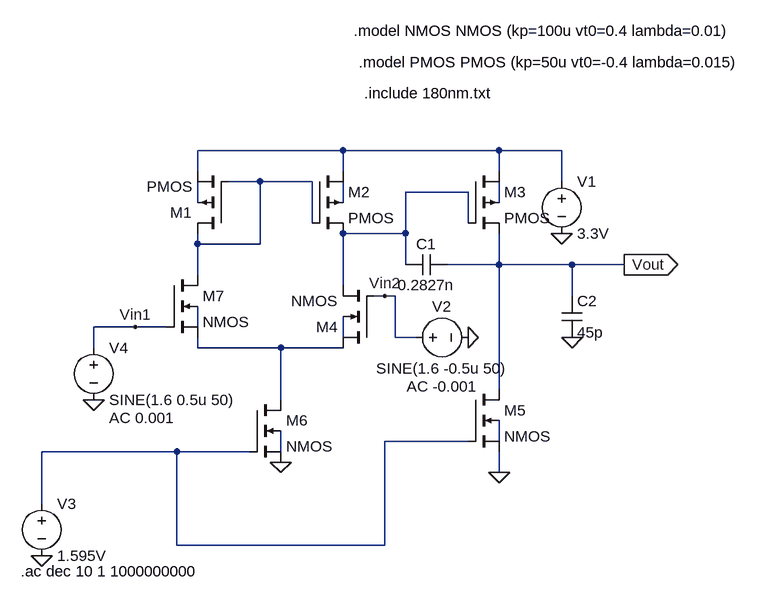
[diagram p0: schematic CourseProjectSchematic.asc]
CourseProjectSchematic.asc, the LTspice schematic file:
Version 4
SHEET 1 976 680
WIRE 272 16 48 16
WIRE 512 16 272 16
WIRE 608 16 512 16
WIRE 48 48 48 16
WIRE 272 48 272 16
WIRE 512 48 512 16
WIRE 144 64 96 64
WIRE 224 64 144 64
WIRE 608 64 608 16
WIRE 464 80 368 80
WIRE 48 96 48 64
WIRE 272 96 272 64
WIRE 512 96 512 64
WIRE 224 128 224 64
WIRE 464 128 464 80
WIRE 368 144 368 80
WIRE 368 144 272 144
WIRE 48 160 48 144
WIRE 144 160 144 64
WIRE 144 160 48 160
WIRE 368 192 368 144
WIRE 512 192 512 144
WIRE 512 192 432 192
WIRE 624 192 512 192
WIRE 704 192 624 192
WIRE 48 208 48 160
WIRE 272 224 272 144
WIRE 336 240 320 240
WIRE 352 240 336 240
WIRE 624 240 624 192
WIRE -48 288 -112 288
WIRE 0 288 -48 288
WIRE 48 288 48 256
WIRE 272 304 272 272
WIRE 352 304 352 240
WIRE 384 304 352 304
WIRE -112 320 -112 288
WIRE 48 320 48 304
WIRE 176 320 48 320
WIRE 272 320 176 320
WIRE 512 384 512 192
WIRE 176 400 176 320
WIRE 464 464 336 464
WIRE 512 464 512 432
WIRE 16 480 -192 480
WIRE 128 480 16 480
WIRE 176 480 176 448
WIRE 512 512 512 480
WIRE -192 560 -192 480
WIRE 16 624 16 480
WIRE 336 624 336 464
WIRE 336 624 16 624
FLAG 608 144 0
FLAG 464 304 0
FLAG 512 512 0
FLAG -192 640 0
FLAG 176 496 0
FLAG -112 400 0
FLAG 704 192 Vout
IOPIN 704 192 Out
FLAG 624 304 0
FLAG -48 288 Vin1
FLAG 336 240 Vin2
SYMBOL pmos4 96 144 R180
SYMATTR InstName M1
SYMATTR Value2 l=0.18u w=0.93u
SYMBOL pmos4 224 48 R0
SYMATTR InstName M2
SYMATTR Value2 l=0.18u w=0.93u
SYMBOL pmos4 464 48 R0
SYMATTR InstName M3
SYMATTR Value2 l=0.18u w=8.784u
SYMBOL voltage 608 48 R0
WINDOW 123 0 0 Left 2
WINDOW 39 0 0 Left 2
SYMATTR InstName V1
SYMATTR Value 3.3V
SYMBOL cap 368 208 R270
WINDOW 0 32 32 VTop 2
WINDOW 3 0 32 VBottom 2
SYMATTR InstName C1
SYMATTR Value 0.2827n
SYMBOL nmos4 320 320 R180
SYMATTR InstName M4
SYMATTR Value2 l=0.18u w=30520u
SYMBOL voltage 368 304 R270
WINDOW 0 32 56 VTop 2
WINDOW 3 -32 56 VBottom 2
WINDOW 123 -60 56 VBottom 2
WINDOW 39 0 0 Left 2
SYMATTR InstName V2
SYMATTR Value SINE(1.6 -0.5u 50)
SYMATTR Value2 AC -0.001
SYMBOL nmos4 464 384 R0
SYMATTR InstName M5
SYMATTR Value2 l=0.18u w=5.04198u
SYMBOL voltage -192 544 R0
WINDOW 123 0 0 Left 2
WINDOW 39 0 0 Left 2
SYMATTR InstName V3
SYMATTR Value 1.595V
SYMBOL nmos4 128 400 R0
SYMATTR InstName M6
SYMATTR Value2 l=0.18u w=1.069u
SYMBOL nmos4 0 208 R0
SYMATTR InstName M7
SYMATTR Value2 l=0.18u w=30520u
SYMBOL voltage -112 304 R0
WINDOW 123 24 124 Left 2
WINDOW 39 0 0 Left 2
SYMATTR Value2 AC 0.001
SYMATTR InstName V4
SYMATTR Value SINE(1.6 0.5u 50)
SYMBOL cap 608 240 R0
SYMATTR InstName C2
SYMATTR Value 45p
TEXT 288 -168 Left 2 !.model NMOS NMOS (kp=100u vt0=0.4 lambda=0.01)
TEXT 296 -120 Left 2 !.model PMOS PMOS (kp=50u vt0=-0.4 lambda=0.015)
TEXT -224 664 Left 2 !.ac dec 10 1 1000000000
TEXT 304 -72 Left 2 !.include 180nm.txt

The netlist it stands for:
* CourseProjectSchematic.asc
M1 N002 N002 N001 N004 PMOS l=0.18u w=0.93u
M2 N001 N002 N003 N005 PMOS l=0.18u w=0.93u
M3 N001 N003 Vout N006 PMOS l=0.18u w=8.784u
V1 N001 0 3.3V
C1 N003 Vout 0.2827n
M4 N009 Vin2 N003 N008 NMOS l=0.18u w=30520u
V2 Vin2 0 SINE(1.6 -0.5u 50) AC -0.001
M5 Vout N010 0 N011 NMOS l=0.18u w=5.04198u
V3 N010 0 1.595V
M6 N009 N010 0 N012 NMOS l=0.18u w=1.069u
M7 N002 Vin1 N009 N007 NMOS l=0.18u w=30520u
V4 Vin1 0 SINE(1.6 0.5u 50) AC 0.001
C2 Vout 0 45p
.model NMOS NMOS
.model PMOS PMOS
.lib standard.mos
.model NMOS NMOS (kp=100u vt0=0.4 lambda=0.01)
.model PMOS PMOS (kp=50u vt0=-0.4 lambda=0.015)
.ac dec 10 1 1000000000
.include 180nm.txt
.backanno
.end